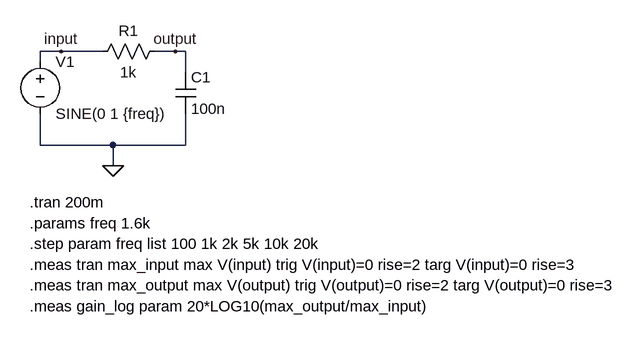
[diagram p0: schematic RC-Tiefpass_Transientenanalyse.asc]
RC-Tiefpass_Transientenanalyse.asc, the LTspice schematic file:
Version 4
SHEET 1 1028 680
WIRE -16 64 -48 64
WIRE 48 64 -16 64
WIRE 160 64 128 64
WIRE 176 64 160 64
WIRE -48 80 -48 64
WIRE 176 96 176 64
WIRE -48 208 -48 160
WIRE 64 208 -48 208
WIRE 176 208 176 160
WIRE 176 208 64 208
WIRE 64 240 64 208
FLAG 64 240 0
FLAG -16 64 input
FLAG 160 64 output
SYMBOL res 32 80 R270
WINDOW 0 32 56 VTop 2
WINDOW 3 0 56 VBottom 2
SYMATTR InstName R1
SYMATTR Value 1k
SYMBOL cap 160 96 R0
SYMATTR InstName C1
SYMATTR Value 100n
SYMBOL voltage -48 64 R0
WINDOW 123 0 0 Left 2
WINDOW 39 0 0 Left 2
SYMATTR InstName V1
SYMATTR Value SINE(0 1 {freq})
TEXT -64 296 Left 2 !.tran 200m
TEXT -64 392 Left 2 !.meas tran max_input max V(input) trig V(input)=0 rise=2 targ V(input)=0 rise=3
TEXT -64 424 Left 2 !.meas tran max_output max V(output) trig V(output)=0 rise=2 targ V(output)=0 rise=3
TEXT -64 456 Left 2 !.meas gain_log param 20*LOG10(max_output/max_input)
TEXT -64 328 Left 2 !.params freq 1.6k
TEXT -64 360 Left 2 !.step param freq list 100 1k 2k 5k 10k 20k

The netlist it stands for:
* RC-Tiefpass_Transientenanalyse.asc
R1 input output 1k
C1 output 0 100n
V1 input 0 SINE(0 1 {freq})
.tran 200m
.meas tran max_input max V(input) trig V(input)=0 rise=2 targ V(input)=0 rise=3
.meas tran max_output max V(output) trig V(output)=0 rise=2 targ V(output)=0 rise=3
.meas gain_log param 20*LOG10(max_output/max_input)
.params freq 1.6k
.step param freq list 100 1k 2k 5k 10k 20k
.backanno
.end